# EAGLE schematic 6WP (EAGLE 9.4.0)

## Sheet 1 of 2
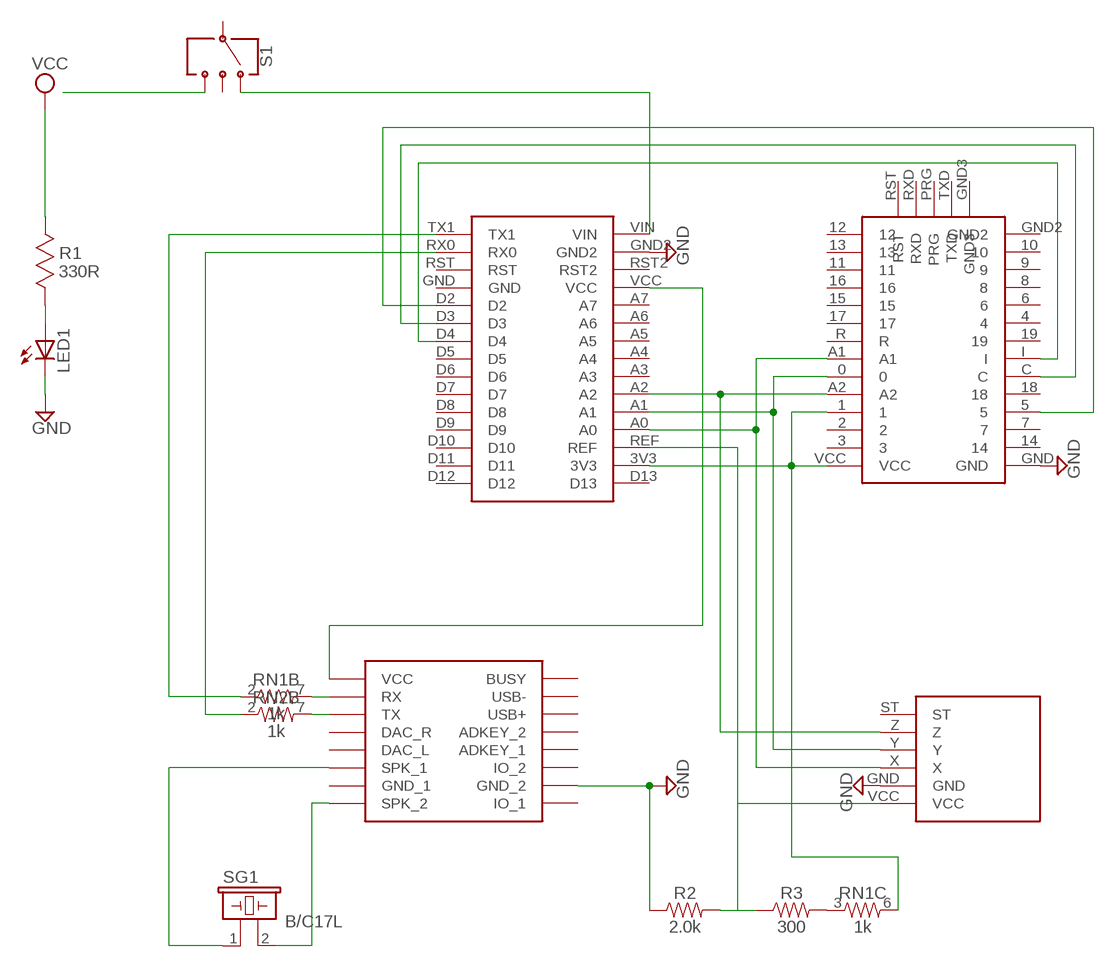
[diagram p0: schematic, sheet 1]

### Parts
A1  ARDUINONANO  [ARDUINONANO]
A2  ADXL335  [ADXL335]
A4  TWELITEDIP  [TWELITEDIP]
LED1  LEDCHIP-LED0603  [CHIP-LED0603]
R1  330R  MC0.063W06031%330R  [RESC1608X60N]
R2  2.0k  2.0KOHM-0603-1/10W-5%  [0603]
R3  300  300OHM-0603-1/10W-1%  [0603]
RN1  1k  1KOHM-ARRAY(4)-0805_ARV-1/10W-5%  [0805-ARV]
RN2  1k  1KOHM-ARRAY(4)-0805_ARV-1/10W-5%  [0805-ARV]
S1  SWITCH-SP3T-SMD  [SWITCH_SP3T_SMD]
SG1  B/C17L  [B/C17L]
U$2  DFPLAYER  [DFPLAYER]

### Nets
GND: A1.GND2 A2.GND A4.GND LED1.C R2.1 U$2.GND_2
N$1: LED1.A R1.2(R2)
N$2: RN2.7 U$2.TX
N$3: A1.3V3 A4.1 A4.VCC RN1.6
N$4: A1.A0 A2.X A4.A1
N$5: A1.A1 A2.Y A4.0
N$6: A1.A2 A2.Z A4.A2
N$7: RN1.7 U$2.RX
N$8: S1.4
N$9: A1.RX0 RN2.2
N$10: A1.TX1 RN1.2
N$11: A1.D2 A4.5
N$12: A1.D3 A4.C
N$13: A1.D4 A4.I
N$14: SG1.1 U$2.SPK1(SPK_1)
N$15: SG1.2 U$2.SPK2(SPK_2)
N$17: A1.VCC U$2.VCC
N$18: A1.VIN S1.1
N$19: R3.2 RN1.3
N$20: A1.REF A2.VCC R2.2 R3.1
VCC: R1.1(R1)
Unconnected: A1.A3 A1.A4 A1.A5 A1.A6 A1.A7 A1.D5 A1.D6 A1.D7 A1.D8 A1.D9 A1.D10 A1.D11 A1.D12 A1.D13 A1.GND A1.RST A1.RST2 A2.ST A4.2 A4.3 A4.4 A4.6 A4.7 A4.8 A4.9 A4.10 A4.11 A4.12 A4.13 A4.14 A4.15 A4.16 A4.17 A4.18 A4.19 A4.GND2 A4.GND3 A4.PRG A4.R A4.RST A4.RXD A4.TXD RN1.1 RN1.4 RN1.5 RN1.8 RN2.1 RN2.3 RN2.4 RN2.5 RN2.6 RN2.8 S1.2 S1.3 U$2.ADKEY1(ADKEY_1) U$2.ADKEY2(ADKEY_2) U$2.BUSY U$2.DAC_L U$2.DAC_R U$2.GND_1 U$2.IO1(IO_1) U$2.IO2(IO_2) U$2.USB+ U$2.USB-

## Sheet 2 of 2
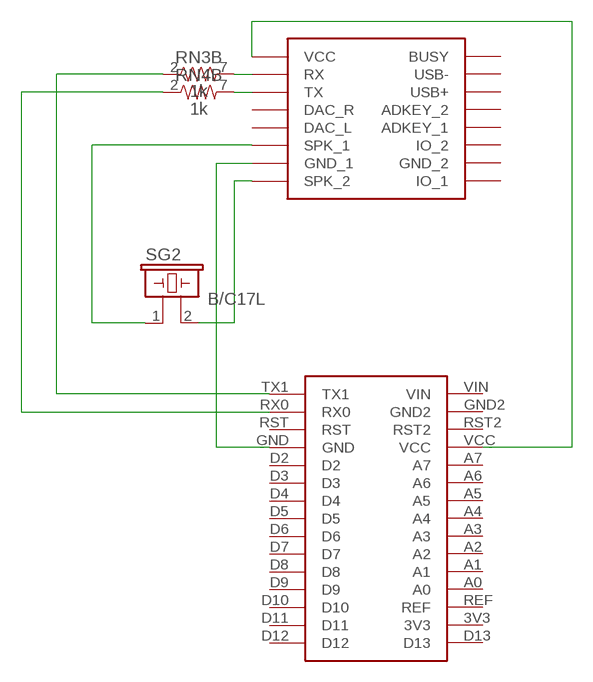
[diagram p1: schematic, sheet 2]

### Parts
A3  ARDUINONANO  [ARDUINONANO]
RN3  1k  1KOHM-ARRAY(4)-0805_ARV-1/10W-5%  [0805-ARV]
RN4  1k  1KOHM-ARRAY(4)-0805_ARV-1/10W-5%  [0805-ARV]
SG2  B/C17L  [B/C17L]
U$1  DFPLAYER  [DFPLAYER]

### Nets
N$16: RN3.7 U$1.RX
N$21: A3.RX0 RN4.2
N$22: A3.TX1 RN3.2
N$23: RN4.7 U$1.TX
N$24: SG2.1 U$1.SPK1(SPK_1)
N$25: SG2.2 U$1.SPK2(SPK_2)
N$27: A3.VCC U$1.VCC
N$28: A3.GND U$1.GND_1
Unconnected: A3.3V3 A3.A0 A3.A1 A3.A2 A3.A3 A3.A4 A3.A5 A3.A6 A3.A7 A3.D2 A3.D3 A3.D4 A3.D5 A3.D6 A3.D7 A3.D8 A3.D9 A3.D10 A3.D11 A3.D12 A3.D13 A3.GND2 A3.REF A3.RST A3.RST2 A3.VIN RN3.1 RN3.3 RN3.4 RN3.5 RN3.6 RN3.8 RN4.1 RN4.3 RN4.4 RN4.5 RN4.6 RN4.8 U$1.ADKEY1(ADKEY_1) U$1.ADKEY2(ADKEY_2) U$1.BUSY U$1.DAC_L U$1.DAC_R U$1.GND_2 U$1.IO1(IO_1) U$1.IO2(IO_2) U$1.USB+ U$1.USB-

## Library data of the parts
A1 A3 = Arduino Nano:ARDUINONANO
A2 = ADXL335:ADXL335
A4 = Twelite Dip:TWELITEDIP
LED1 = led:LED: LED OSRAM: - CHIPLED LG R971, LG N971, LY N971, LG Q971, LY Q971, LO R971, LY R971 LH N974, LH R974 LS Q976, LO Q976, LY Q976 LO Q996 - Hyper CHIPLED LW Q18S LB Q993, LB Q99A, LB R99A - SideLED LS A670, LO A670, LY A670, LG A670, LP A670 LB A673, LV A673, LT A673, LW A673 LH A674 LY A675 LS A676, LA A676, LO A676, LY A676, LW A676 LS A679, LY A679, LG A679 - Hyper Micro SIDELED® LS Y876, LA Y876, LO Y876, LY Y876 LT Y87S - SmartLED LW L88C, LW L88S LB L89C, LB L89S, LG L890 LS L89K, LO L89K, LY L89K LS L896, LA L896, LO L896, LY L896 - TOPLED LS T670, LO T670, LY T670, LG T670, LP T670 LSG T670, LSP T670, LSY T670, LOP T670, LYG T670 LG T671, LOG T671, LSG T671 LB T673, LV T673, LT T673, LW T673 LH T674 LS T676, LA T676, LO T676, LY T676, LB T676, LH T676, LSB T676, LW T676 LB T67C, LV T67C, LT T67C, LS T67K, LO T67K, LY T67K, LW E67C LS E67B, LA E67B, LO E67B, LY E67B, LB E67C, LV E67C, LT E67C LW T67C LS T679, LY T679, LG T679 LS T770, LO T770, LY T770, LG T770, LP T770 LB T773, LV T773, LT T773, LW T773 LH T774 LS E675, LA E675, LY E675, LS T675 LS T776, LA T776, LO T776, LY T776, LB T776 LHGB T686 LT T68C, LB T68C - Hyper Mini TOPLED® LB M676 - Mini TOPLED Santana® LG M470 LS M47K, LO M47K, LY M47K Source: http://www.osram.convergy.de LUXEON: - LUMILED® LXK2-PW12-R00, LXK2-PW12-S00, LXK2-PW14-U00, LXK2-PW14-V00 LXK2-PM12-R00, LXK2-PM12-S00, LXK2-PM14-U00 LXK2-PE12-Q00, LXK2-PE12-R00, LXK2-PE12-S00, LXK2-PE14-T00, LXK2-PE14-U00 LXK2-PB12-K00, LXK2-PB12-L00, LXK2-PB12-M00, LXK2-PB14-N00, LXK2-PB14-P00, LXK2-PB14-Q00 LXK2-PR12-L00, LXK2-PR12-M00, LXK2-PR14-Q00, LXK2-PR14-R00 LXK2-PD12-Q00, LXK2-PD12-R00, LXK2-PD12-S00 LXK2-PH12-R00, LXK2-PH12-S00 LXK2-PL12-P00, LXK2-PL12-Q00, LXK2-PL12-R00 Source: www.luxeon.com KINGBRIGHT: KA-3528ASYC Source: www.kingbright.com
R1 = Multicomp:MC0.063W06031%330R: RESISTOR, 0603; MPN: MC0.063W06031%330R; OC_FARNELL: 9331018; OC_NEWARK: -; SUPPLIER: Multicomp; TOLERANCE: ±1%; VALUE: 330 Ohms; WATTAGE: 1/16 W
R2 = SparkFun-Resistors:2.0KOHM: 2kΩ resistor A resistor is a passive two-terminal electrical component that implements electrical resistance as a circuit element. Resistors act to reduce current flow, and, at the same time, act to lower voltage levels within circuits. - Wikipedia; PROD_ID: RES-08296
R3 = SparkFun-Resistors:300OHM: 300Ω resistor A resistor is a passive two-terminal electrical component that implements electrical resistance as a circuit element. Resistors act to reduce current flow, and, at the same time, act to lower voltage levels within circuits. - Wikipedia; PROD_ID: RES_10328
RN1-RN4 = SparkFun-Resistors:1KOHM-ARRAY(4): 4 x 1kΩ resistor array A resistor is a passive two-terminal electrical component that implements electrical resistance as a circuit element. Resistors act to reduce current flow, and, at the same time, act to lower voltage levels within circuits. - Wikipedia An array is a collection of discrete resistors in a single package.; PROD_ID: RES-13020
S1 = SparkFun-Switches:SWITCH-SP3T: Single-Pole, Triple-Throw (SP3T) Switch Single-Pole, Triple-Throw switches SparkFun Products Prototype Part; PROD_ID: SWCH-10805
SG1 SG2 = buzzer:B/C17L: BUZZER Source: Buerklin; OC_FARNELL: unknown; OC_NEWARK: unknown
U$1 U$2 = DFPlayer_v1:DFPLAYER